# Altium project PCB_MCU.PrjPcb
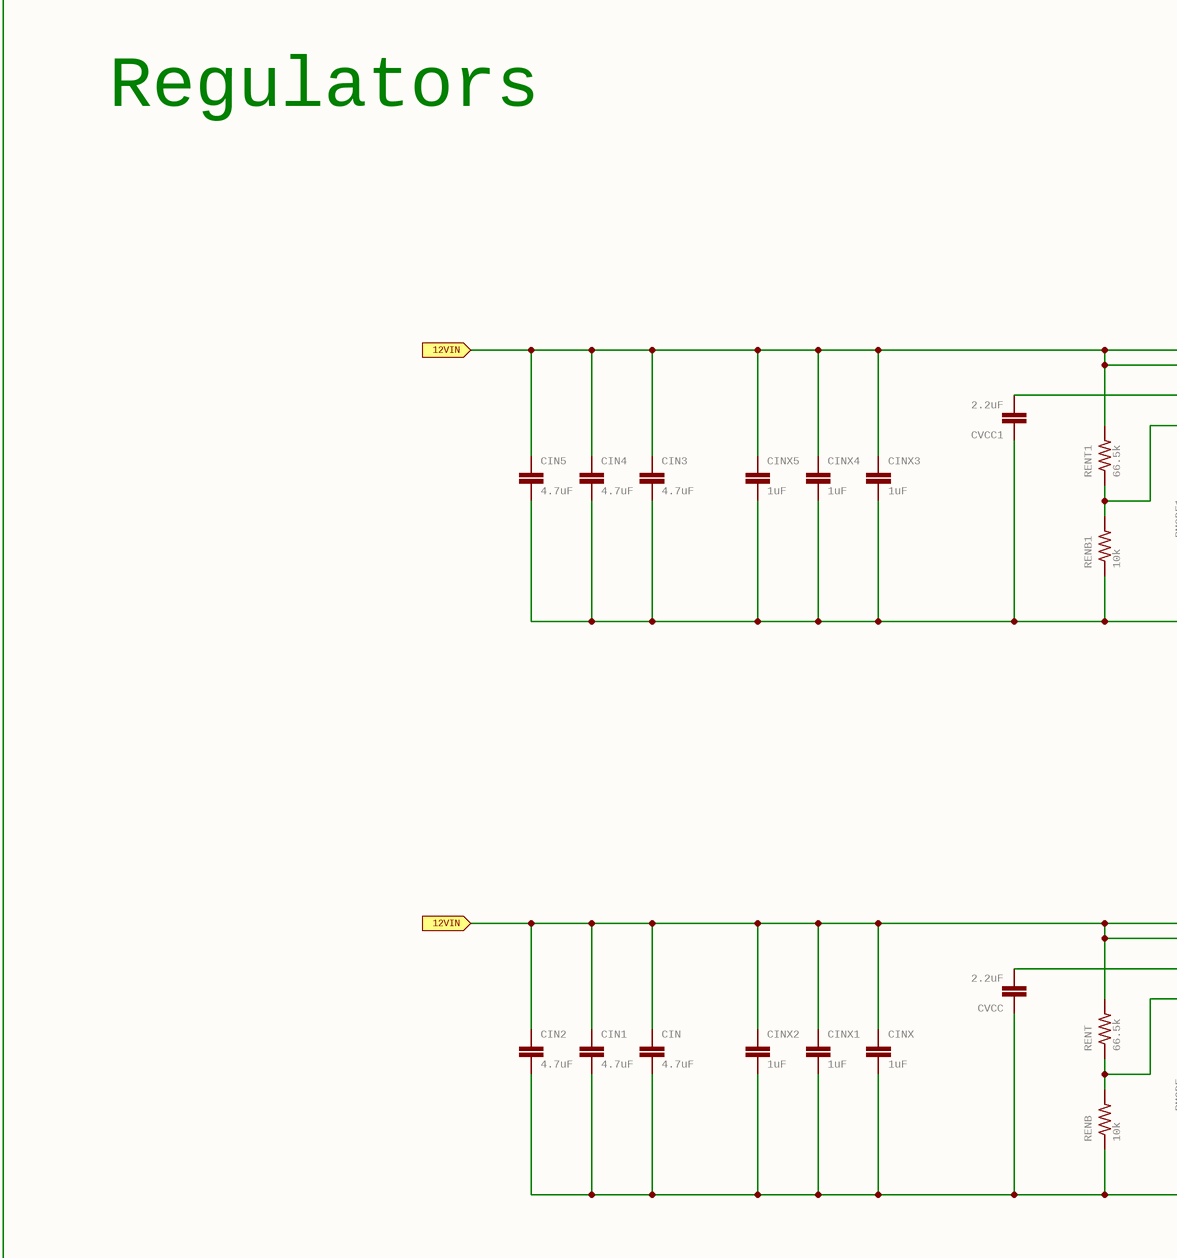
[diagram p0: PCB_MCU.SchDoc, top column 1 of 5]
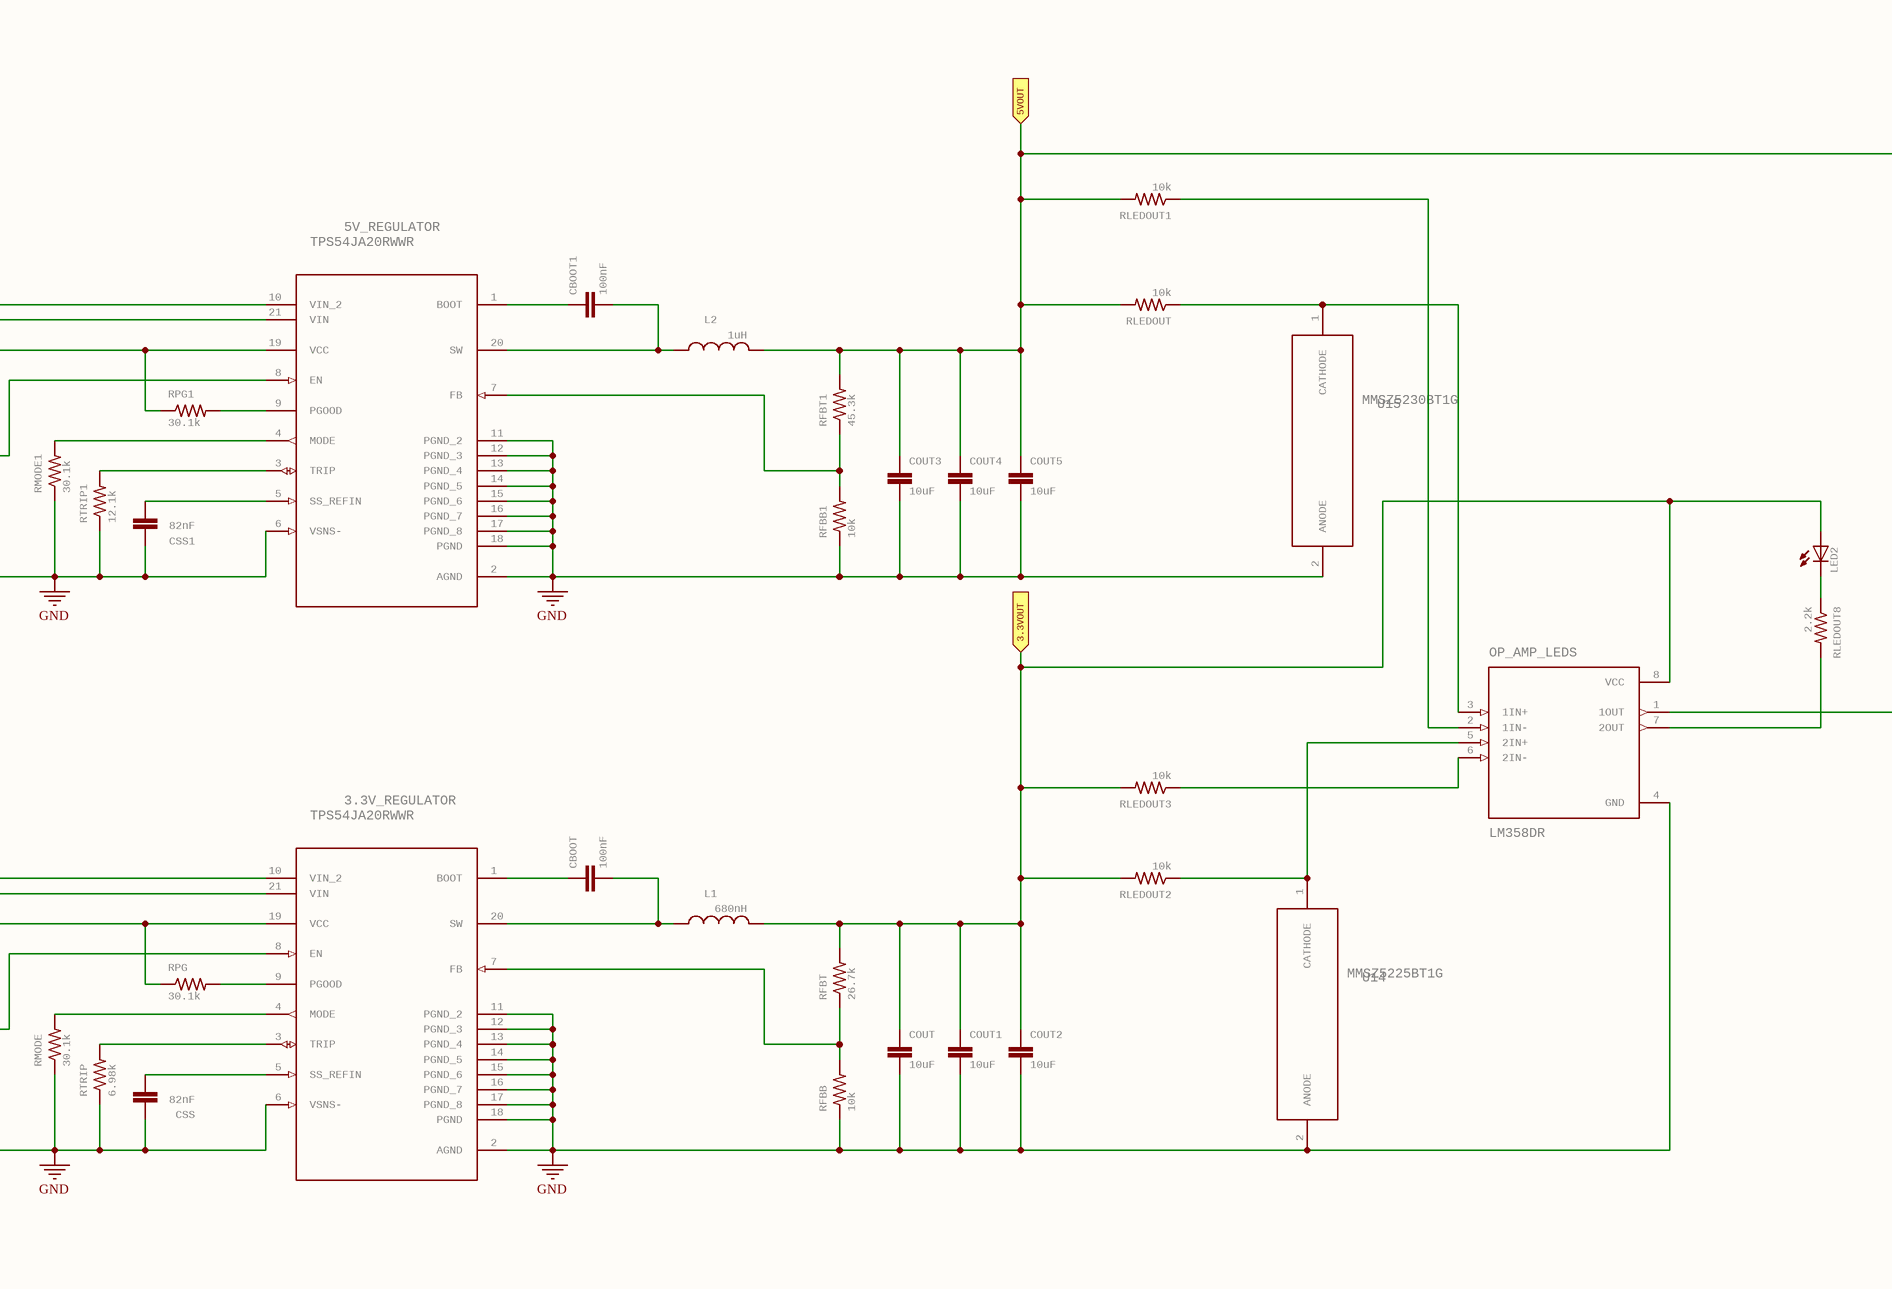
[diagram p1: PCB_MCU.SchDoc, top column 2 of 5]
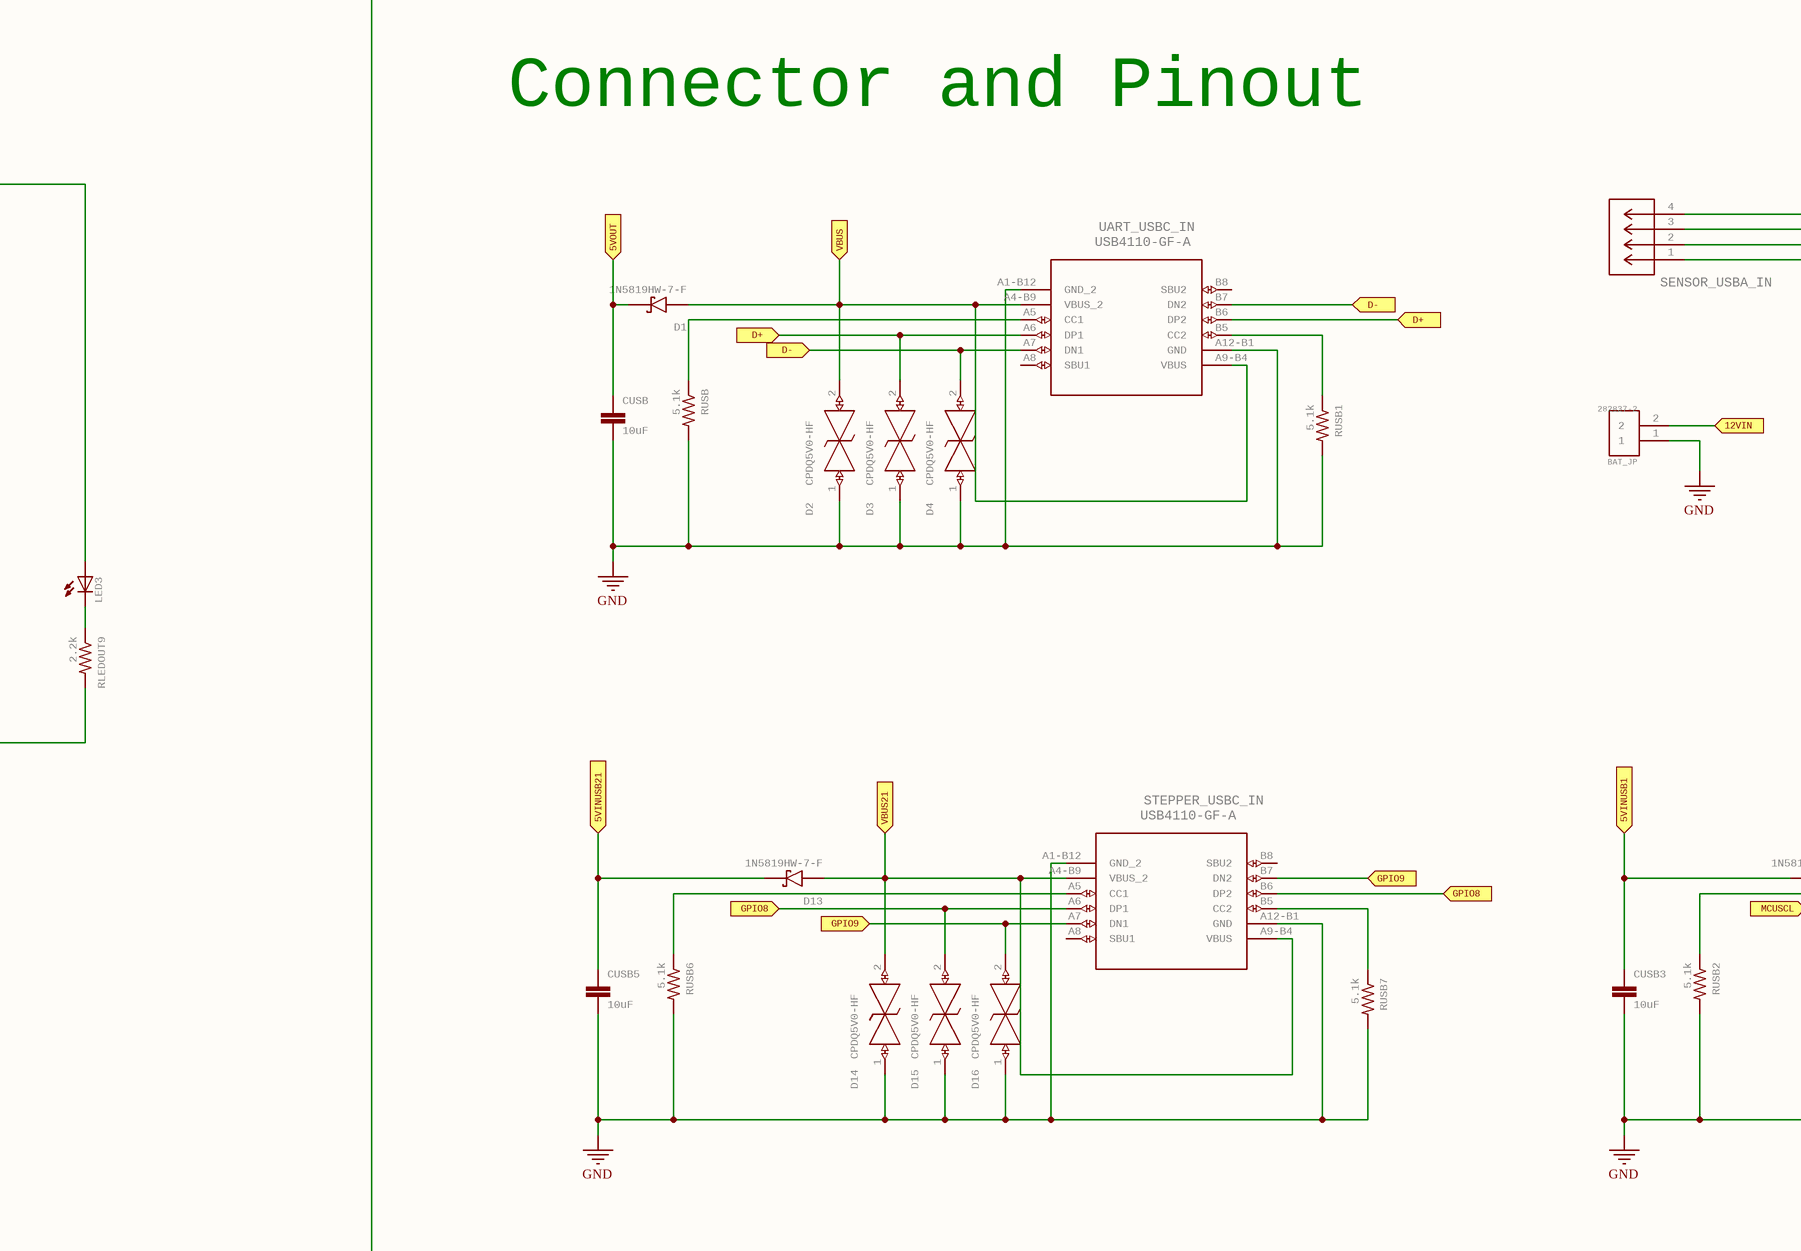
[diagram p2: PCB_MCU.SchDoc, top column 3 of 5]
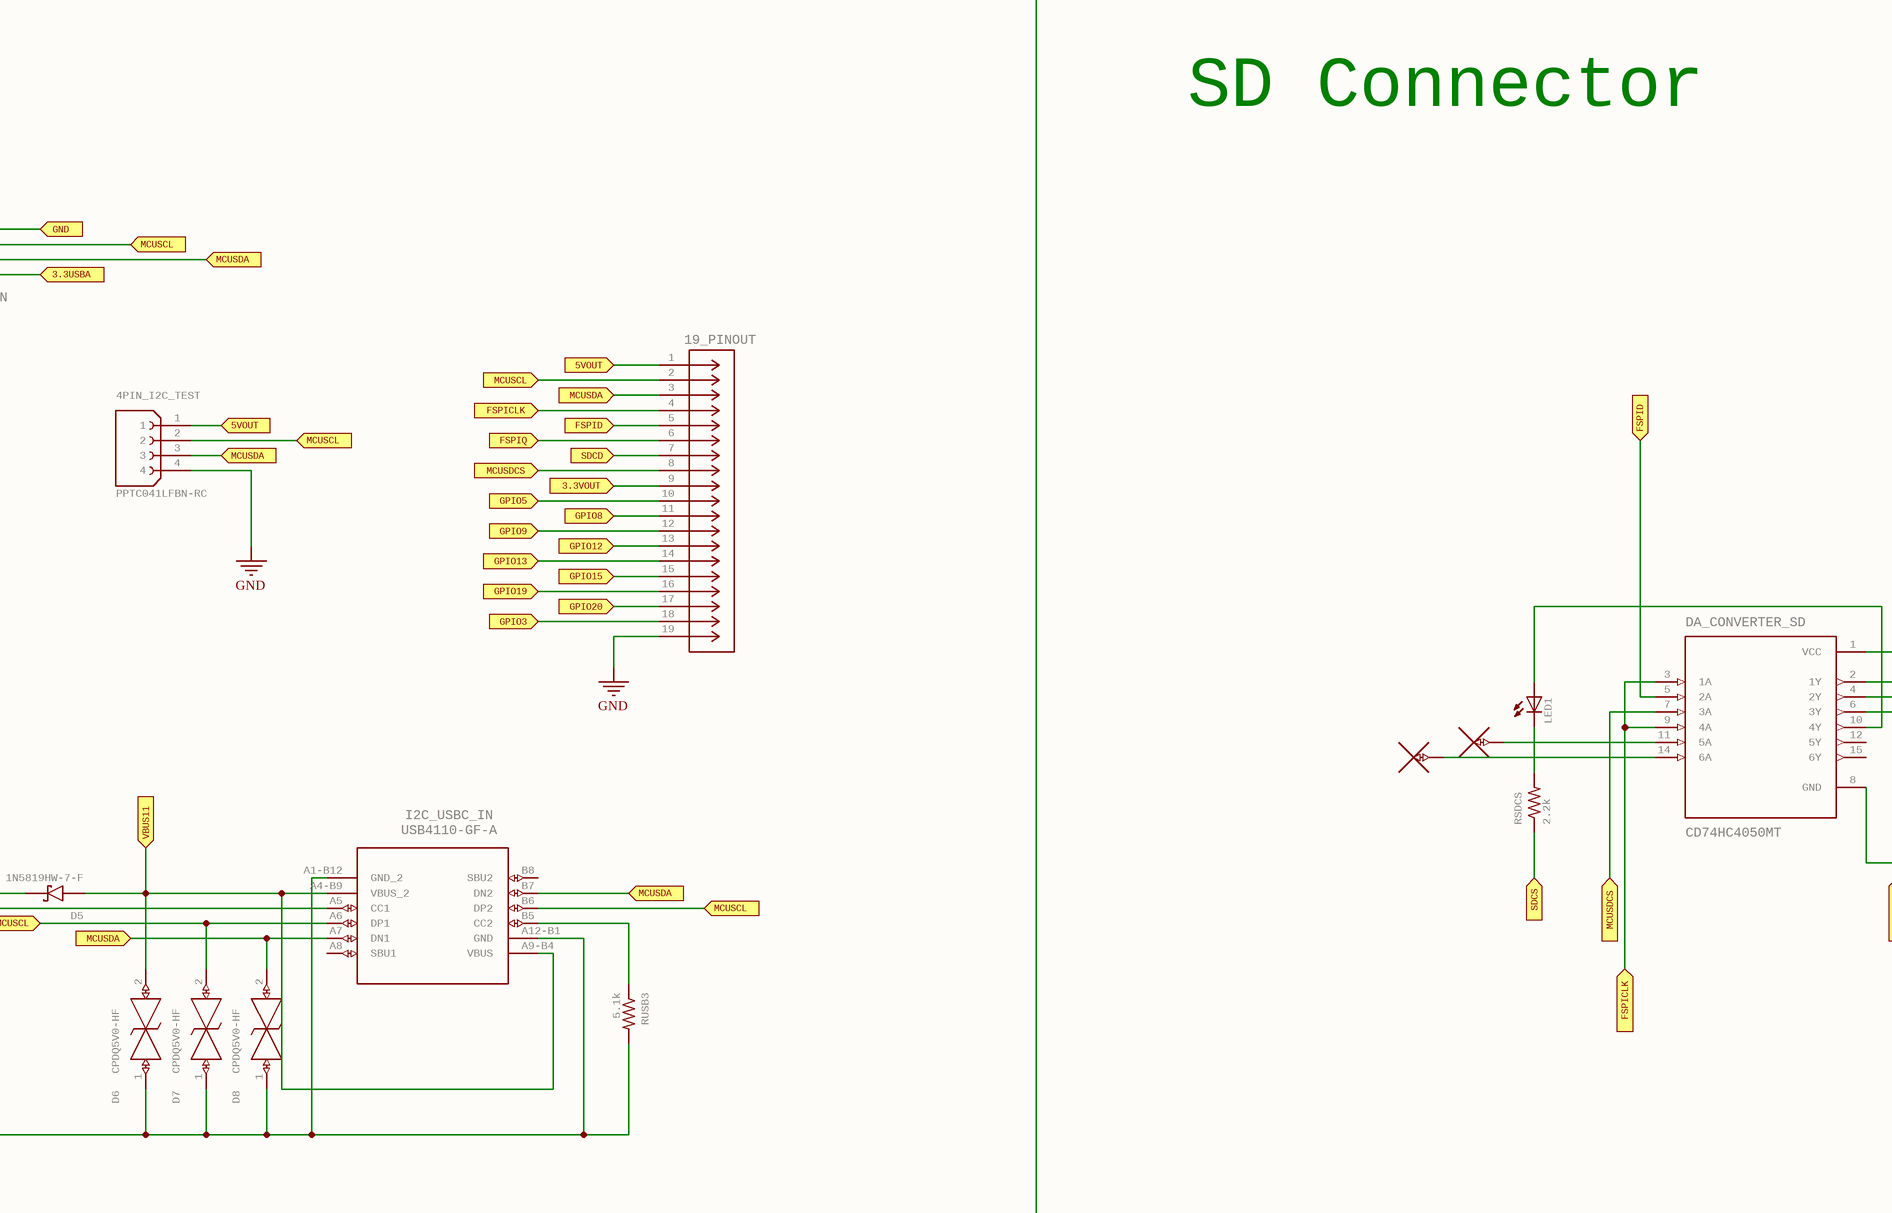
[diagram p3: PCB_MCU.SchDoc, top column 4 of 5]
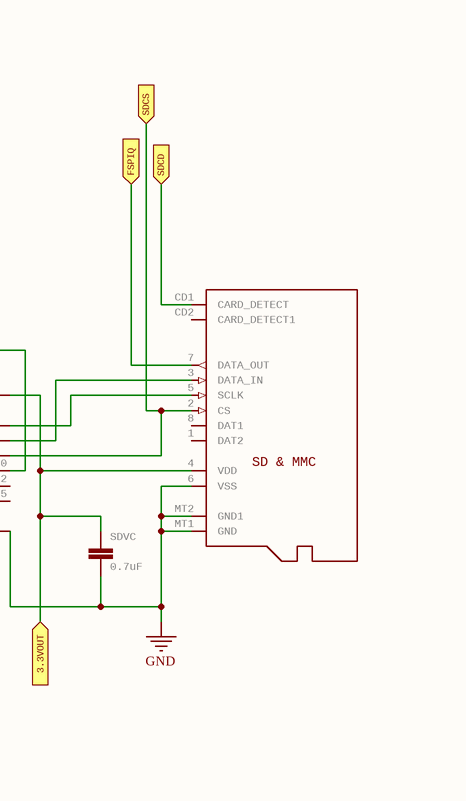
[diagram p4: PCB_MCU.SchDoc, top column 5 of 5]
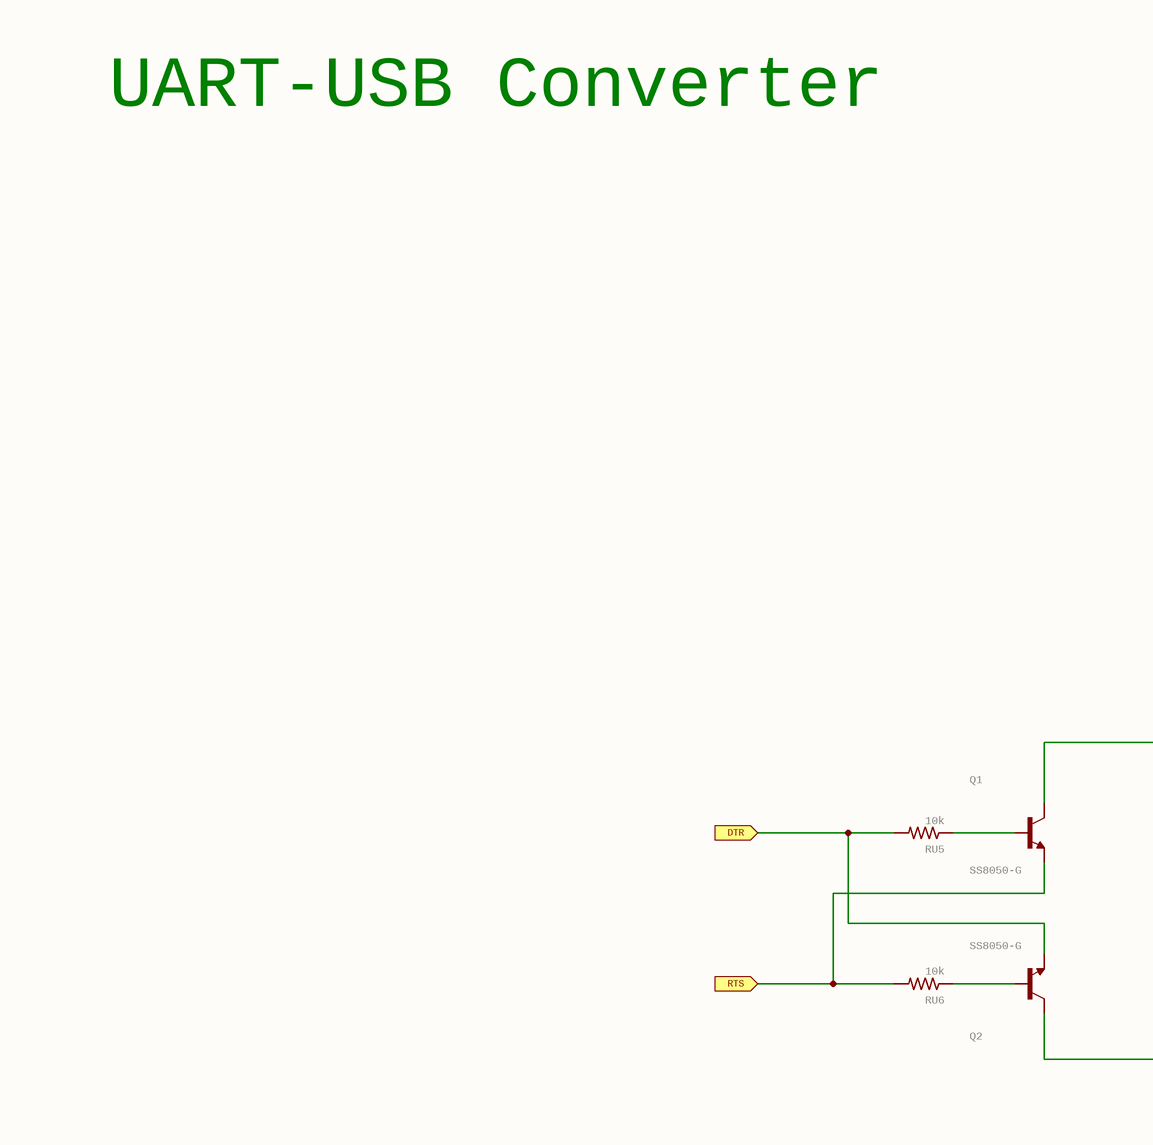
[diagram p5: PCB_MCU.SchDoc, bottom column 1 of 5]
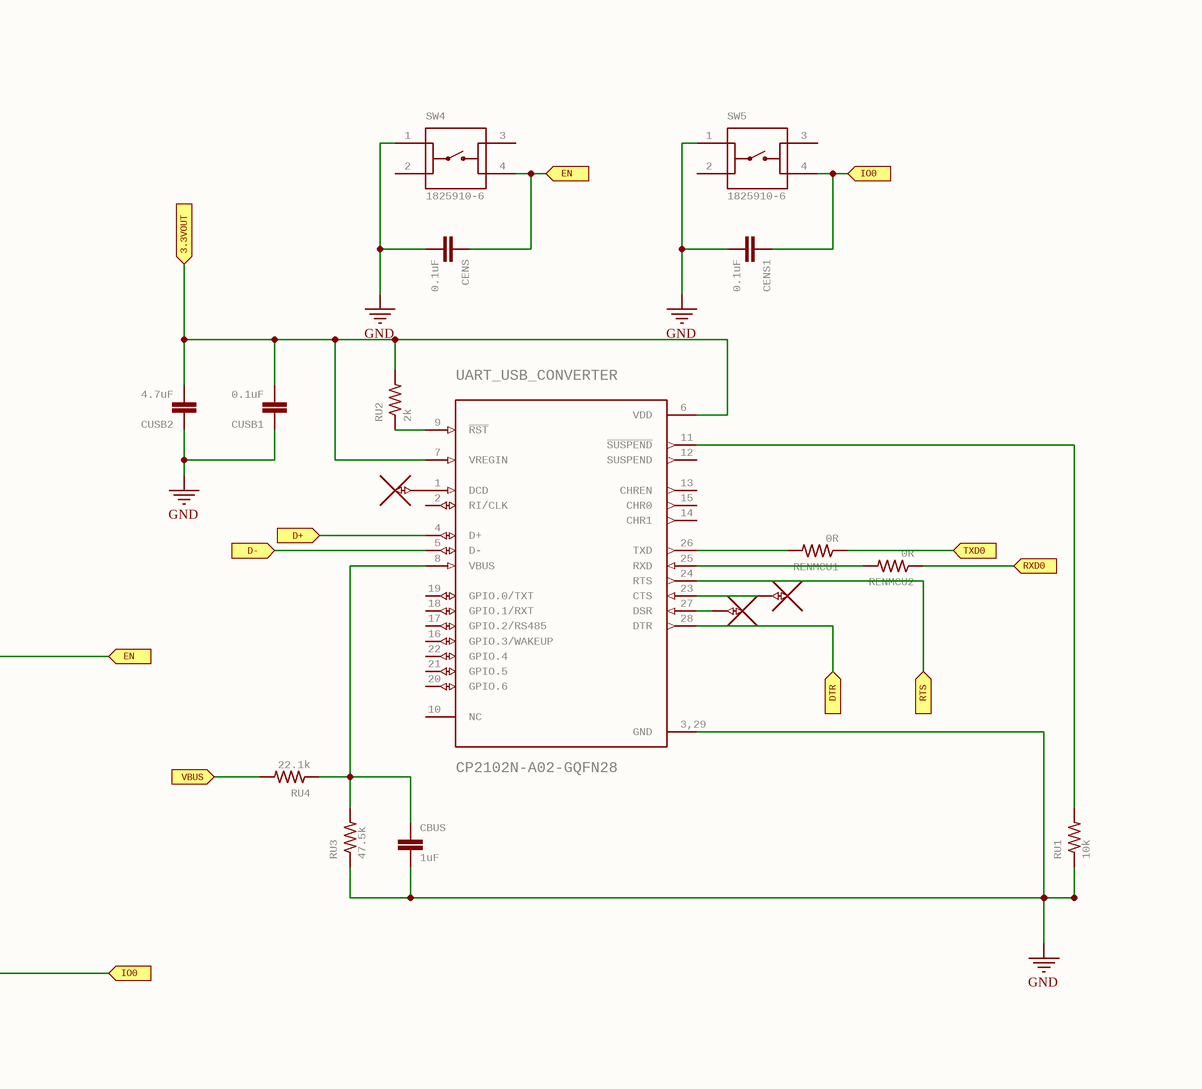
[diagram p6: PCB_MCU.SchDoc, bottom column 2 of 5]
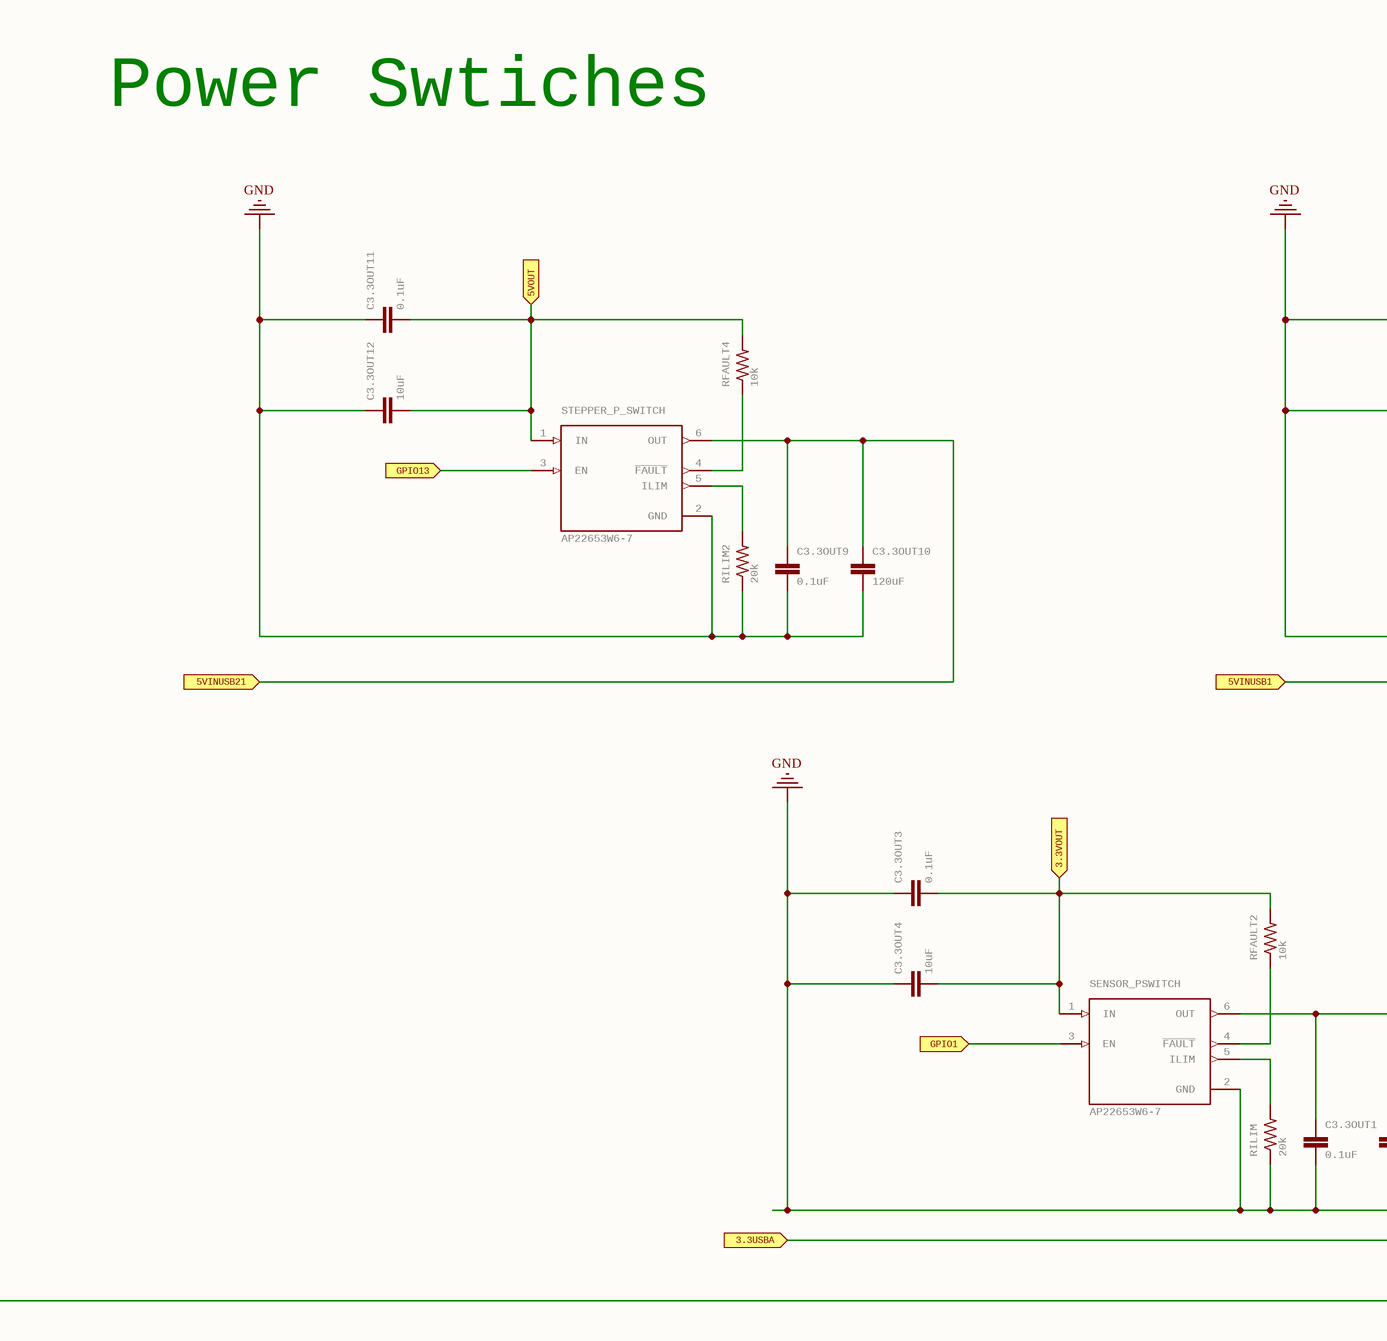
[diagram p7: PCB_MCU.SchDoc, bottom column 3 of 5]
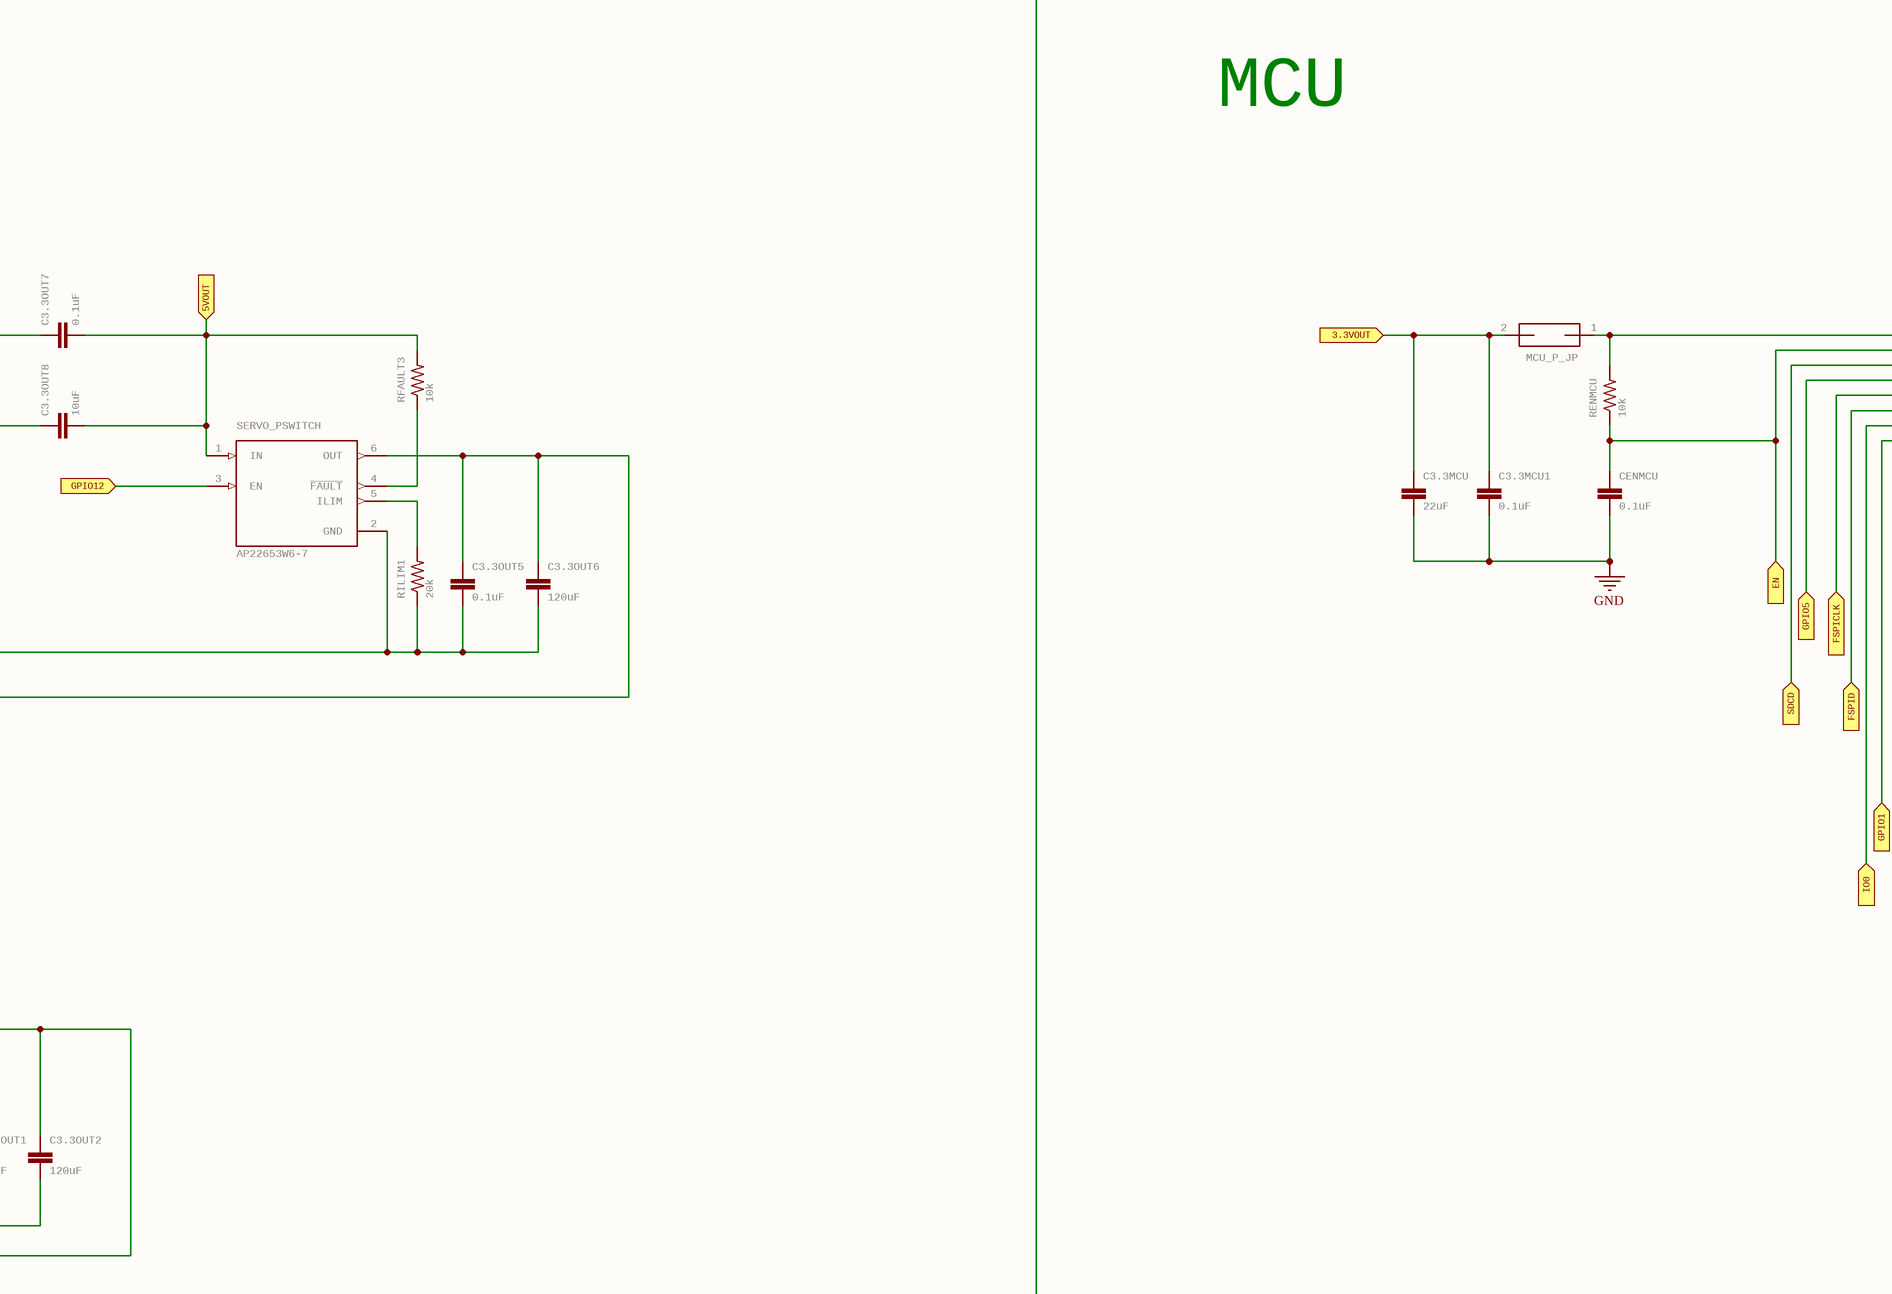
[diagram p8: PCB_MCU.SchDoc, bottom column 4 of 5]
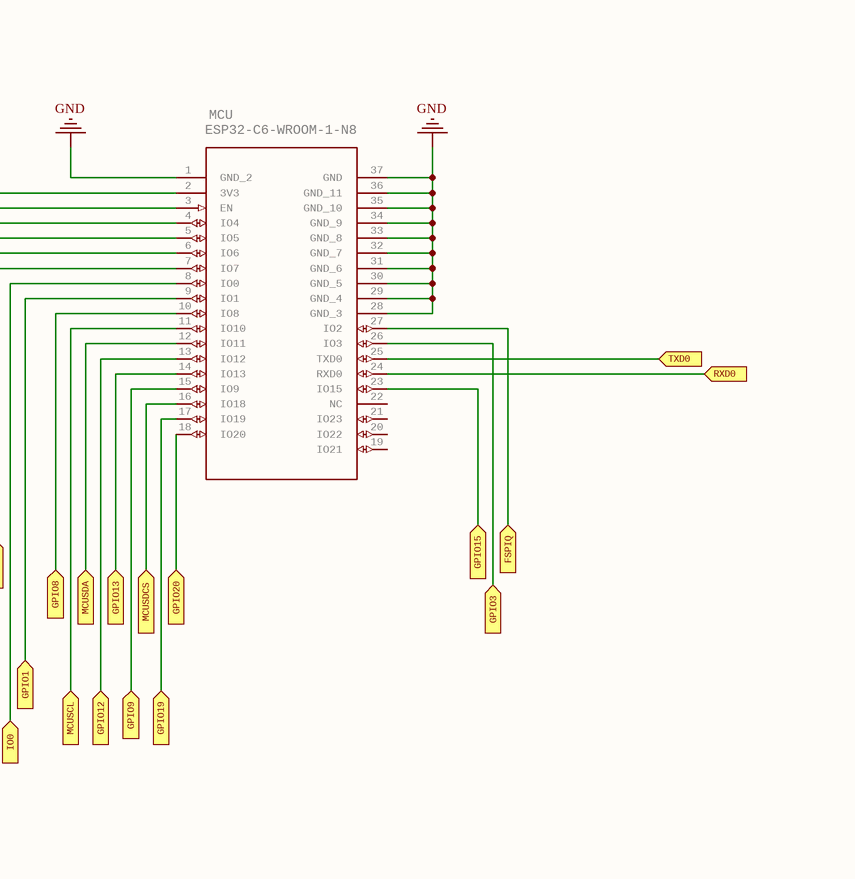
[diagram p9: PCB_MCU.SchDoc, bottom column 5 of 5]
1 sheet, 136 parts. Net scope: flat (ports and power ports of the same name join across sheets).

## Sheet PCB_MCU.SchDoc
size 1424 x 515 mm; Origin: Eagle

### Parts
3.3V_REGULATOR  TPS54JA20RWWR  [RWW0021A]
4PIN_I2C_TEST  PPTC041LFBN-RC  [SULLINS_PPTC041LFBN-RC]
5V_REGULATOR  TPS54JA20RWWR  [RWW0021A]
19_PINOUT  PPTC191LFBN-RC  [CONN19_PPTC191LFBN-RC_SUL]  (value not drawn)
BAT_JP  282837-2  [TE_282837-2]
C3.3MCU  22uF  [C0805]
C3.3MCU1  0.1uF  [C0805]
C3.3OUT1  0.1uF  [C0805]
C3.3OUT2  120uF  [C0805]
C3.3OUT3  0.1uF  [C0805]
C3.3OUT4  10uF  [C0805]
C3.3OUT5  0.1uF  [C0805]
C3.3OUT6  120uF  [C0805]
C3.3OUT7  0.1uF  [C0805]
C3.3OUT8  10uF  [C0805]
C3.3OUT9  0.1uF  [C0805]
C3.3OUT10  120uF  [C0805]
C3.3OUT11  0.1uF  [C0805]
C3.3OUT12  10uF  [C0805]
CBOOT  100nF  [C0805]
CBOOT1  100nF  [C0805]
CBUS  1uF  [C0805]
CENMCU  0.1uF  [C0805]
CENS  0.1uF  [C0805]
CENS1  0.1uF  [C0805]
CIN  4.7uF  [C0805]
CIN1  4.7uF  [C0805]
CIN2  4.7uF  [C0805]
CIN3  4.7uF  [C0805]
CIN4  4.7uF  [C0805]
CIN5  4.7uF  [C0805]
CINX  1uF  [C0805]
CINX1  1uF  [C0805]
CINX2  1uF  [C0805]
CINX3  1uF  [C0805]
CINX4  1uF  [C0805]
CINX5  1uF  [C0805]
COUT  10uF  [C0805]
COUT1  10uF  [C0805]
COUT2  10uF  [C0805]
COUT3  10uF  [C0805]
COUT4  10uF  [C0805]
COUT5  10uF  [C0805]
CSS  82nF  [C0805]
CSS1  82nF  [C0805]
CTS_NC  NC_MARKER  (value not drawn)
CUSB  10uF  [C0805]
CUSB1  0.1uF  [C0805]
CUSB2  4.7uF  [C0805]
CUSB3  10uF  [C0805]
CUSB5  10uF  [C0805]
CVCC  2.2uF  [C0805]
CVCC1  2.2uF  [C0805]
D1  1N5819HW-7-F  [SOD3715X145N]
D2  CPDQ5V0-HF  [MBTB-D-SOD-923F-IMP-0402]
D3  CPDQ5V0-HF  [MBTB-D-SOD-923F-IMP-0402]
D4  CPDQ5V0-HF  [MBTB-D-SOD-923F-IMP-0402]
D5  1N5819HW-7-F  [SOD3715X145N]
D6  CPDQ5V0-HF  [MBTB-D-SOD-923F-IMP-0402]
D7  CPDQ5V0-HF  [MBTB-D-SOD-923F-IMP-0402]
D8  CPDQ5V0-HF  [MBTB-D-SOD-923F-IMP-0402]
D13  1N5819HW-7-F  [SOD3715X145N]
D14  CPDQ5V0-HF  [MBTB-D-SOD-923F-IMP-0402]
D15  CPDQ5V0-HF  [MBTB-D-SOD-923F-IMP-0402]
D16  CPDQ5V0-HF  [MBTB-D-SOD-923F-IMP-0402]
DA_CONVERTER_SD  CD74HC4050MT  [SOIC127P600X175-16N]
DCD_NC  NC_MARKER  (value not drawn)
I2C_USBC_IN  USB4110-GF-A  [USB4110-GF-A_GCT]
L1  680nH  [6000-XXXX-RC]
L2  1uH  [6000-XXXX-RC]
LED1  LED  [SMARTLED-TTW]  (value not drawn)
LED2  LED  [SMARTLED-TTW]  (value not drawn)
LED3  LED  [SMARTLED-TTW]  (value not drawn)
MCU  ESP32-C6-WROOM-1-N8  [MOD28_ESP32-C6-WROOM-1_EXP]
MCU_P_JP  JP1Q  [JP1]  (value not drawn)
OP_AMP_LEDS  LM358DR  [SOIC127P599X175-8N]
Q1  SS8050-G  [TRANS_SS8050-G]
Q2  SS8050-G  [TRANS_SS8050-G]
RENB  10k  [M0805]
RENB1  10k  [M0805]
RENMCU  10k  [M0805]
RENMCU1  0R  [M0805]
RENMCU2  0R  [M0805]
RENT  66.5k  [M0805]
RENT1  66.5k  [M0805]
RFAULT2  10k  [M0805]
RFAULT3  10k  [M0805]
RFAULT4  10k  [M0805]
RFBB  10k  [M0805]
RFBB1  10k  [M0805]
RFBT  26.7k  [M0805]
RFBT1  45.3k  [M0805]
RILIM  20k  [M0805]
RILIM1  20k  [M0805]
RILIM2  20k  [M0805]
RLEDOUT  10k  [M0805]
RLEDOUT1  10k  [M0805]
RLEDOUT2  10k  [M0805]
RLEDOUT3  10k  [M0805]
RLEDOUT8  2.2k  [M0805]
RLEDOUT9  2.2k  [M0805]
RMODE  30.1k  [M0805]
RMODE1  30.1k  [M0805]
RPG  30.1k  [M0805]
RPG1  30.1k  [M0805]
RSDCS  2.2k  [M0805]
RTRIP  6.98k  [M0805]
RTRIP1  12.1k  [M0805]
RU1  10k  [M0805]
RU2  2k  [M0805]
RU3  47.5k  [M0805]
RU4  22.1k  [M0805]
RU5  10k  [M0805]
RU6  10k  [M0805]
RUSB  5.1k  [M0805]
RUSB1  5.1k  [M0805]
RUSB2  5.1k  [M0805]
RUSB3  5.1k  [M0805]
RUSB6  5.1k  [M0805]
RUSB7  5.1k  [M0805]
SD_CONNECTOR  SD&MMC: SD & MMC  [MICROSD]  (hidden comment: MICROSD)
SDVC  0.7uF  [C0805]
SENSOR_PSWITCH  AP22653W6-7  [SOT95P280X145-6N]
SENSOR_USBA_IN  USB-AP-S-RA-SMT  [CONN_USB-AP-S-RA-SMT_ADM]  (value not drawn)
SERVO_PSWITCH  AP22653W6-7  [SOT95P280X145-6N]
STEPPER_P_SWITCH  AP22653W6-7  [SOT95P280X145-6N]
STEPPER_USBC_IN  USB4110-GF-A  [USB4110-GF-A_GCT]
SW4  1825910-6  [SW_1825910-6-4]
SW5  1825910-6  [SW_1825910-6-4]
U14  MMSZ5225BT1G  [SOD-123_ONS]
U15  MMSZ5230BT1G  [SOD-123_ONS]
U$2  NC_MARKER  (value not drawn)
U$10  NC_MARKER  (value not drawn)
U$11  NC_MARKER  (value not drawn)
UART_USB_CONVERTER  CP2102N-A02-GQFN28  [QFN50P500X500X80-29N]
UART_USBC_IN  USB4110-GF-A  [USB4110-GF-A_GCT]

### Blocks framed on the sheet
Regulators: 3.3V_REGULATOR 5V_REGULATOR CBOOT CBOOT1 CIN CIN1-CIN5 CINX CINX1-CINX5 COUT COUT1-COUT5 CSS CSS1 CVCC CVCC1 L1 L2 LED2 LED3 OP_AMP_LEDS RENB RENB1 RENT RENT1 RFBB RFBB1 RFBT RFBT1 RLEDOUT RLEDOUT1-RLEDOUT3 RLEDOUT8 RLEDOUT9 RMODE RMODE1 RPG RPG1 RTRIP RTRIP1 U14 U15
Connector and Pinout: 4PIN_I2C_TEST 19_PINOUT BAT_JP CUSB CUSB3 CUSB5 D1-D8 D13-D16 I2C_USBC_IN RUSB RUSB1-RUSB3 RUSB6 RUSB7 SENSOR_USBA_IN STEPPER_USBC_IN UART_USBC_IN
SD Connector: DA_CONVERTER_SD LED1 RSDCS SD_CONNECTOR SDVC U$10 U$11
UART-USB Converter: CBUS CENS CENS1 CTS_NC CUSB1 CUSB2 DCD_NC Q1 Q2 RENMCU1 RENMCU2 RU1-RU6 SW4 SW5 U$2 UART_USB_CONVERTER
Power Swtiches: C3.3OUT1-C3.3OUT12 RFAULT2-RFAULT4 RILIM RILIM1 RILIM2 SENSOR_PSWITCH SERVO_PSWITCH STEPPER_P_SWITCH
MCU: C3.3MCU C3.3MCU1 CENMCU MCU MCU_P_JP RENMCU

### Ports
3.3USBA (in), 3.3VOUT (in), 5VINUSB1 (in), 5VINUSB21 (in), 5VOUT (in), 12VIN (in), D+ (in), D- (in), DTR (in), EN (in), FSPICLK (in), FSPID (in), FSPIQ (in), GND (in), GPIO1 (in), GPIO3 (in), GPIO5 (in), GPIO8 (in), GPIO9 (in), GPIO12 (in), GPIO13 (in), GPIO15 (in), GPIO19 (in), GPIO20 (in), IO0 (in), MCUSCL (in), MCUSDA (in), MCUSDCS (in), RTS (in), RXD0 (in), SDCD (in), SDCS (in), TXD0 (in), VBUS11 (in), VBUS21 (in), VBUS (in)

### Nets
GND: 3.3V_REGULATOR.2(AGND) 3.3V_REGULATOR.6(VSNS-) 3.3V_REGULATOR.11(PGND_2) 3.3V_REGULATOR.12(PGND_3) 3.3V_REGULATOR.13(PGND_4) 3.3V_REGULATOR.14(PGND_5) 3.3V_REGULATOR.15(PGND_6) 3.3V_REGULATOR.16(PGND_7) 3.3V_REGULATOR.17(PGND_8) 3.3V_REGULATOR.18(PGND) 4PIN_I2C_TEST.4 5V_REGULATOR.2(AGND) 5V_REGULATOR.6(VSNS-) 5V_REGULATOR.11(PGND_2) 5V_REGULATOR.12(PGND_3) 5V_REGULATOR.13(PGND_4) 5V_REGULATOR.14(PGND_5) 5V_REGULATOR.15(PGND_6) 5V_REGULATOR.16(PGND_7) 5V_REGULATOR.17(PGND_8) 5V_REGULATOR.18(PGND) 19_PINOUT.19 BAT_JP.1 C3.3MCU.2 C3.3MCU1.2 C3.3OUT1.2 C3.3OUT2.2 C3.3OUT3.1 C3.3OUT4.1 C3.3OUT5.2 C3.3OUT6.2 C3.3OUT7.1 C3.3OUT8.1 C3.3OUT9.2 C3.3OUT10.2 C3.3OUT11.1 C3.3OUT12.1 CBUS.2 CENMCU.2 CENS.2 CENS1.2 CIN.2 CIN1.2 CIN2.2 CIN3.2 CIN4.2 CIN5.2 CINX.2 CINX1.2 CINX2.2 CINX3.2 CINX4.2 CINX5.2 COUT.2 COUT1.2 COUT2.2 COUT3.2 COUT4.2 COUT5.2 CSS.1 CSS1.1 CUSB.2 CUSB1.1 CUSB2.1 CUSB3.2 CUSB5.2 CVCC.1 CVCC1.1 D2.1(K) D3.1(K) D4.1(K) D6.1(K) D7.1(K) D8.1(K) D14.1(K) D15.1(K) D16.1(K) DA_CONVERTER_SD.8(GND) I2C_USBC_IN.A1-B12(GND_2) I2C_USBC_IN.A12-B1(GND) MCU.1(GND_2) MCU.28(GND_3) MCU.29(GND_4) MCU.30(GND_5) MCU.31(GND_6) MCU.32(GND_7) MCU.33(GND_8) MCU.34(GND_9) MCU.35(GND_10) MCU.36(GND_11) MCU.37(GND) OP_AMP_LEDS.4(GND) RENB.1 RENB1.1 RFBB.1 RFBB1.1 RILIM.1 RILIM1.1 RILIM2.1 RMODE.1 RMODE1.1 RTRIP.1 RTRIP1.1 RU1.1 RU3.1 RUSB.2 RUSB1.2 RUSB2.2 RUSB3.2 RUSB6.2 RUSB7.2 SD_CONNECTOR.6(VSS) SD_CONNECTOR.MT1(GND) SD_CONNECTOR.MT2(GND1) SDVC.2 SENSOR_PSWITCH.2(GND) SERVO_PSWITCH.2(GND) STEPPER_P_SWITCH.2(GND) STEPPER_USBC_IN.A1-B12(GND_2) STEPPER_USBC_IN.A12-B1(GND) SW4.1 SW5.1 U14.2(ANODE) U15.2(ANODE) UART_USB_CONVERTER.3,29(GND) UART_USBC_IN.A1-B12(GND_2) UART_USBC_IN.A12-B1(GND)
Net3.3V_REGULATOR_1: 3.3V_REGULATOR.1(BOOT) CBOOT.1
Net3.3V_REGULATOR_3: 3.3V_REGULATOR.3(TRIP) RTRIP.2
Net3.3V_REGULATOR_4: 3.3V_REGULATOR.4(MODE) RMODE.2
Net3.3V_REGULATOR_5: 3.3V_REGULATOR.5(SS_REFIN) CSS.2
Net3.3V_REGULATOR_7: 3.3V_REGULATOR.7(FB) RFBB.2 RFBT.1
Net3.3V_REGULATOR_8: 3.3V_REGULATOR.8(EN) RENB.2 RENT.1
Net3.3V_REGULATOR_9: 3.3V_REGULATOR.9(PGOOD) RPG.2
Net3.3V_REGULATOR_10: 3.3V_REGULATOR.10(VIN_2) 3.3V_REGULATOR.21(VIN) 5V_REGULATOR.10(VIN_2) 5V_REGULATOR.21(VIN) BAT_JP.2 CIN.1 CIN1.1 CIN2.1 CIN3.1 CIN4.1 CIN5.1 CINX.1 CINX1.1 CINX2.1 CINX3.1 CINX4.1 CINX5.1 RENT.2 RENT1.2 ; port 12VIN
Net3.3V_REGULATOR_19: 3.3V_REGULATOR.19(VCC) CVCC.2 RPG.1
Net3.3V_REGULATOR_20: 3.3V_REGULATOR.20(SW) CBOOT.2 L1.1
Net4PIN_I2C_TEST_1: 4PIN_I2C_TEST.1 19_PINOUT.1 C3.3OUT7.2 C3.3OUT8.2 C3.3OUT11.2 C3.3OUT12.2 COUT3.1 COUT4.1 COUT5.1 CUSB.1 D1.C(K) L2.2 LED3.A@1(A) RFAULT3.2 RFAULT4.2 RFBT1.2 RLEDOUT.2 RLEDOUT1.2 SERVO_PSWITCH.1(IN) STEPPER_P_SWITCH.1(IN) ; port 5VOUT
Net4PIN_I2C_TEST_2: 4PIN_I2C_TEST.2 19_PINOUT.2 D7.2(A) I2C_USBC_IN.A6(DP1) I2C_USBC_IN.B6(DP2) MCU.11(IO10) SENSOR_USBA_IN.3 ; port MCUSCL
Net4PIN_I2C_TEST_3: 4PIN_I2C_TEST.3 19_PINOUT.3 D8.2(A) I2C_USBC_IN.A7(DN1) I2C_USBC_IN.B7(DN2) MCU.12(IO11) SENSOR_USBA_IN.2 ; port MCUSDA
Net5V_REGULATOR_1: 5V_REGULATOR.1(BOOT) CBOOT1.1
Net5V_REGULATOR_3: 5V_REGULATOR.3(TRIP) RTRIP1.2
Net5V_REGULATOR_4: 5V_REGULATOR.4(MODE) RMODE1.2
Net5V_REGULATOR_5: 5V_REGULATOR.5(SS_REFIN) CSS1.2
Net5V_REGULATOR_7: 5V_REGULATOR.7(FB) RFBB1.2 RFBT1.1
Net5V_REGULATOR_8: 5V_REGULATOR.8(EN) RENB1.2 RENT1.1
Net5V_REGULATOR_9: 5V_REGULATOR.9(PGOOD) RPG1.2
Net5V_REGULATOR_19: 5V_REGULATOR.19(VCC) CVCC1.2 RPG1.1
Net5V_REGULATOR_20: 5V_REGULATOR.20(SW) CBOOT1.2 L2.1
Net19_PINOUT_4: 19_PINOUT.4 DA_CONVERTER_SD.3(1A) DA_CONVERTER_SD.9(4A) MCU.6(IO6) ; port FSPICLK
Net19_PINOUT_5: 19_PINOUT.5 DA_CONVERTER_SD.5(2A) MCU.7(IO7) ; port FSPID
Net19_PINOUT_6: 19_PINOUT.6 MCU.27(IO2) SD_CONNECTOR.7(DATA_OUT) ; port FSPIQ
Net19_PINOUT_7: 19_PINOUT.7 MCU.4(IO4) SD_CONNECTOR.CD1(CARD_DETECT) ; port SDCD
Net19_PINOUT_8: 19_PINOUT.8 DA_CONVERTER_SD.7(3A) MCU.16(IO18) ; port MCUSDCS
Net19_PINOUT_9: 19_PINOUT.9 C3.3MCU.1 C3.3MCU1.1 C3.3OUT3.2 C3.3OUT4.2 COUT.1 COUT1.1 COUT2.1 CUSB1.2 CUSB2.2 DA_CONVERTER_SD.1(VCC) L1.2 LED2.A@1(A) MCU_P_JP.2 OP_AMP_LEDS.8(VCC) RFAULT2.2 RFBT.2 RLEDOUT2.2 RLEDOUT3.2 RU2.2 SD_CONNECTOR.4(VDD) SDVC.1 SENSOR_PSWITCH.1(IN) UART_USB_CONVERTER.6(VDD) UART_USB_CONVERTER.7(VREGIN) ; port 3.3VOUT
Net19_PINOUT_10: 19_PINOUT.10 MCU.5(IO5) ; port GPIO5
Net19_PINOUT_11: 19_PINOUT.11 D15.2(A) MCU.10(IO8) STEPPER_USBC_IN.A6(DP1) STEPPER_USBC_IN.B6(DP2) ; port GPIO8
Net19_PINOUT_12: 19_PINOUT.12 D16.2(A) MCU.15(IO9) STEPPER_USBC_IN.A7(DN1) STEPPER_USBC_IN.B7(DN2) ; port GPIO9
Net19_PINOUT_13: 19_PINOUT.13 MCU.13(IO12) SERVO_PSWITCH.3(EN) ; port GPIO12
Net19_PINOUT_14: 19_PINOUT.14 MCU.14(IO13) STEPPER_P_SWITCH.3(EN) ; port GPIO13
Net19_PINOUT_15: 19_PINOUT.15 MCU.23(IO15) ; port GPIO15
Net19_PINOUT_16: 19_PINOUT.16 MCU.17(IO19) ; port GPIO19
Net19_PINOUT_17: 19_PINOUT.17 MCU.18(IO20) ; port GPIO20
Net19_PINOUT_18: 19_PINOUT.18 MCU.26(IO3) ; port GPIO3
NetC3.3OUT1_1: C3.3OUT1.1 C3.3OUT2.1 SENSOR_PSWITCH.6(OUT) SENSOR_USBA_IN.1 ; port 3.3USBA
NetC3.3OUT5_1: C3.3OUT5.1 C3.3OUT6.1 CUSB3.1 D5.C(K) SERVO_PSWITCH.6(OUT) ; port 5VINUSB1
NetC3.3OUT9_1: C3.3OUT9.1 C3.3OUT10.1 CUSB5.1 D13.C(K) STEPPER_P_SWITCH.6(OUT) ; port 5VINUSB21
NetCBUS_1: CBUS.1 RU3.2 RU4.1 UART_USB_CONVERTER.8(VBUS)
NetCENMCU_1: CENMCU.1 CENS.1 MCU.3(EN) Q1.3(C) RENMCU.1 SW4.4 ; port EN
NetCENS1_1: CENS1.1 MCU.8(IO0) Q2.3(C) SW5.4 ; port IO0
NetCTS_NC_?1: CTS_NC.?1(P$1) UART_USB_CONVERTER.23(CTS)
NetD1_A: D1.A D2.2(A) RU4.2 UART_USBC_IN.A4-B9(VBUS_2) UART_USBC_IN.A9-B4(VBUS) ; port VBUS
NetD3_2: D3.2(A) UART_USB_CONVERTER.4(D+) UART_USBC_IN.A6(DP1) UART_USBC_IN.B6(DP2) ; port D+
NetD4_2: D4.2(A) UART_USB_CONVERTER.5(D-) UART_USBC_IN.A7(DN1) UART_USBC_IN.B7(DN2) ; port D-
NetD5_A: D5.A D6.2(A) I2C_USBC_IN.A4-B9(VBUS_2) I2C_USBC_IN.A9-B4(VBUS) ; port VBUS11
NetD13_A: D13.A D14.2(A) STEPPER_USBC_IN.A4-B9(VBUS_2) STEPPER_USBC_IN.A9-B4(VBUS) ; port VBUS21
NetDA_CONVERTER_SD_2: DA_CONVERTER_SD.2(1Y) SD_CONNECTOR.5(SCLK)
NetDA_CONVERTER_SD_4: DA_CONVERTER_SD.4(2Y) SD_CONNECTOR.3(DATA_IN)
NetDA_CONVERTER_SD_6: DA_CONVERTER_SD.6(3Y) RSDCS.1 SD_CONNECTOR.2(CS) ; port SDCS
NetDA_CONVERTER_SD_10: DA_CONVERTER_SD.10(4Y) LED1.A@1(A)
NetDA_CONVERTER_SD_11: DA_CONVERTER_SD.11(5A) U$10.?1(P$1)
NetDA_CONVERTER_SD_14: DA_CONVERTER_SD.14(6A) U$11.?1(P$1)
NetDCD_NC_?1: DCD_NC.?1(P$1) UART_USB_CONVERTER.1(DCD)
NetI2C_USBC_IN_A5: I2C_USBC_IN.A5(CC1) RUSB2.1
NetI2C_USBC_IN_B5: I2C_USBC_IN.B5(CC2) RUSB3.1
NetLED1_C@1: LED1.C@1(C) RSDCS.2
NetLED2_C@1: LED2.C@1(C) RLEDOUT8.1
NetLED3_C@1: LED3.C@1(C) RLEDOUT9.1
NetMCU_2: MCU.2(3V3) MCU_P_JP.1 RENMCU.2
NetMCU_9: MCU.9(IO1) SENSOR_PSWITCH.3(EN) ; port GPIO1
NetMCU_24: MCU.24(RXD0) RENMCU2.1 ; port RXD0
NetMCU_25: MCU.25(TXD0) RENMCU1.1 ; port TXD0
NetOP_AMP_LEDS_1: OP_AMP_LEDS.1(1OUT) RLEDOUT9.2
NetOP_AMP_LEDS_2: OP_AMP_LEDS.2(1IN-) RLEDOUT1.1
NetOP_AMP_LEDS_3: OP_AMP_LEDS.3(1IN+) RLEDOUT.1 U15.1(CATHODE)
NetOP_AMP_LEDS_5: OP_AMP_LEDS.5(2IN+) RLEDOUT2.1 U14.1(CATHODE)
NetOP_AMP_LEDS_6: OP_AMP_LEDS.6(2IN-) RLEDOUT3.1
NetOP_AMP_LEDS_7: OP_AMP_LEDS.7(2OUT) RLEDOUT8.2
NetQ1_1: Q1.1(B) RU5.1
NetQ1_2: Q1.2(E) RU6.2 UART_USB_CONVERTER.24(RTS) ; port RTS
NetQ2_1: Q2.1(B) RU6.1
NetQ2_2: Q2.2(E) RU5.2 UART_USB_CONVERTER.28(DTR) ; port DTR
NetRENMCU1_2: RENMCU1.2 UART_USB_CONVERTER.26(TXD)
NetRENMCU2_2: RENMCU2.2 UART_USB_CONVERTER.25(RXD)
NetRFAULT2_1: RFAULT2.1 SENSOR_PSWITCH.4(~{FAULT})
NetRFAULT3_1: RFAULT3.1 SERVO_PSWITCH.4(~{FAULT})
NetRFAULT4_1: RFAULT4.1 STEPPER_P_SWITCH.4(~{FAULT})
NetRILIM1_2: RILIM1.2 SERVO_PSWITCH.5(ILIM)
NetRILIM2_2: RILIM2.2 STEPPER_P_SWITCH.5(ILIM)
NetRILIM_2: RILIM.2 SENSOR_PSWITCH.5(ILIM)
NetRU1_2: RU1.2 UART_USB_CONVERTER.11(~{SUSPEND})
NetRU2_1: RU2.1 UART_USB_CONVERTER.9(~{RST})
NetRUSB1_1: RUSB1.1 UART_USBC_IN.B5(CC2)
NetRUSB6_1: RUSB6.1 STEPPER_USBC_IN.A5(CC1)
NetRUSB7_1: RUSB7.1 STEPPER_USBC_IN.B5(CC2)
NetRUSB_1: RUSB.1 UART_USBC_IN.A5(CC1)
NetSENSOR_USBA_IN_4: SENSOR_USBA_IN.4 ; port GND
NetU$2_?1: U$2.?1(P$1) UART_USB_CONVERTER.27(DSR)

Not connected (* = marked no-connect by the designer): DA_CONVERTER_SD 12(5Y) 15(6Y); I2C_USBC_IN A8(SBU1) B8(SBU2); MCU 19(IO21) 20(IO22) 21(IO23) 22(NC); SD_CONNECTOR 1(DAT2) 8(DAT1) CD2(CARD_DETECT1); STEPPER_USBC_IN A8(SBU1) B8(SBU2); SW4 2 3; SW5 2 3; UART_USB_CONVERTER 2(RI/CLK) 10(NC) 12(SUSPEND) 13(CHREN) 14(CHR1) 15(CHR0) 16(GPIO.3/WAKEUP) 17(GPIO.2/RS485) 18(GPIO.1/RXT) 19(GPIO.0/TXT) 20(GPIO.6) 21(GPIO.5) 22(GPIO.4); UART_USBC_IN A8(SBU1) B8(SBU2)

### Library data of the parts
3.3V_REGULATOR 5V_REGULATOR = TPS54JA20RWWR: GateName_1: A; SymbolName_1: TPS54JA20RWW; LibraryName: TPS54JA20RWWR; DeviceSetName: TPS54JA20RWWR; MANUFACTURER_PART_NUMBER: TPS54JA20RWWR
4PIN_I2C_TEST = PPTC041LFBN-RC: 4 Position Header Connector Through Hole  Check availability; GateName_1: G$1; MF: Sullins Connector; SymbolName_1: PPTC041LFBN-RC; LibraryName: PPTC041LFBN-RC; DeviceSetName: PPTC041LFBN-RC; AVAILABILITY: In Stock; CHECK_PRICES: https://www.snapeda.com/parts/PPTC041LFBN-RC/Sullins+Connector+Solutions/view-part/?ref=eda; MP: PPTC041LFBN-RC; PACKAGE: None; PRICE: None; PURCHASE-URL: https://www.snapeda.com/api/url_track_click_mouser/?unipart_id=285917&manufacturer=Sullins Connector&part_name=PPTC041LFBN-RC&search_term=pptc041lfbn-rc; SNAPEDA_LINK: https://www.snapeda.com/parts/PPTC041LFBN-RC/Sullins+Connector+Solutions/view-part/?ref=snap
19_PINOUT = PPTC191LFBN-RC: MFR_NAME: Sullins; GateName_1: A; SymbolName_1: CONN19_PPTC191LFBN-RC; LibraryName: PPTC191LFBN-RC; DeviceSetName: PPTC191LFBN-RC; COPYRIGHT: Copyright (C) 2023 Ultra Librarian. All rights reserved.; MANUFACTURER_PART_NUMBER: PPTC191LFBN-RC; TYPE: Headers, Receptacles, Female Sockets
BAT_JP = 282837-2: TERM BLOCK 5.08MM 2POS SIDE ENTY Check availability; GateName_1: G$1; MF: TE Connectivity; SymbolName_1: 282837-2; LibraryName: Terminal_Block2P; DeviceSetName: 282837-2; AVAILABILITY: In Stock; CHECK_PRICES: https://www.snapeda.com/parts/282837-2/TE+Connectivity+AMP+Connectors/view-part/?ref=eda; MP: 282837-2; PACKAGE: None; PRICE: None; PURCHASE-URL: https://pricing.snapeda.com/search?q=282837-2&ref=eda; SNAPEDA_LINK: https://www.snapeda.com/parts/282837-2/TE+Connectivity+AMP+Connectors/view-part/?ref=snap
C3.3MCU C3.3MCU1 C3.3OUT1-C3.3OUT12 CBOOT CBOOT1 CBUS CENMCU CENS CENS1 CIN CIN1-CIN5 CINX CINX1-CINX5 COUT COUT1-COUT5 CSS CSS1 CUSB CUSB1-CUSB3 CUSB5 CVCC CVCC1 SDVC = C-EUC0805: CAPACITOR, European symbol; GateName_1: G$1; SymbolName_1: C-EU; POPULARITY: 88; DeviceName: C0805; LibraryName: rcl; DeviceSetName: C-EU; SPICEPREFIX: C
CTS_NC DCD_NC U$2 U$10 U$11 = NC_MARKER: GateName_1: G$1; SymbolName_1: NO_CONNECT_MARKER; LibraryName: NC_MARKER; DeviceSetName: NC_MARKER; _EXTERNAL_: _EXTERNAL_
D1 D5 D13 = 1N5819HW-7-F: 1N5819HW Series 40 V 1 A Surface Mount Schottky Barrier Rectifier - SOD-123 Check availability; GateName_1: G$1; MF: Diodes Inc.; SymbolName_1: 1N5819HW-7-F; LibraryName: 1N5819HW-7-F; DeviceSetName: 1N5819HW-7-F; AVAILABILITY: In Stock; CHECK_PRICES: https://www.snapeda.com/parts/1N5819HW-7-F/Diodes+Inc./view-part/?ref=eda; MP: 1N5819HW-7-F; PACKAGE: SOD-123 Fairchild Semiconductor; PRICE: None; PURCHASE-URL: https://www.snapeda.com/api/url_track_click_mouser/?unipart_id=42272&manufacturer=Diodes Inc.&part_name=1N5819HW-7-F&search_term=1n5819hw-7-f; SNAPEDA_LINK: https://www.snapeda.com/parts/1N5819HW-7-F/Diodes+Inc./view-part/?ref=snap
D2-D4 D6-D8 D14-D16 = CPDQ5V0-HF: ESD Suppressors / TVS Diodes SMD ESD Diode 5V Bi-Direction   Source:  Datasheet   Check availability; GateName_1: G$1; MF: Comchip Technology; SymbolName_1: CPDQ5V0-HF; LibraryName: CPDQ5V0-HF; DeviceSetName: CPDQ5V0-HF; AVAILABILITY: In Stock; CHECK_PRICES: https://www.snapeda.com/parts/CPDQ5V0-HF/Comchip+Technology/view-part/?ref=eda; MP: CPDQ5V0-HF; PACKAGE: 0402 Comchip; PRICE: None; PURCHASE-URL: https://www.snapeda.com/api/url_track_click_mouser/?unipart_id=809934&manufacturer=Comchip Technology&part_name=CPDQ5V0-HF&search_term=cpdq5v0-hf; SNAPEDA_LINK: https://www.snapeda.com/parts/CPDQ5V0-HF/Comchip+Technology/view-part/?ref=snap
DA_CONVERTER_SD = CD74HC4050MT: Check availability; GateName_1: A; MF: Texas Instruments; SymbolName_1: CD74HC4050MT; LibraryName: CD74HC4050MT; DeviceSetName: CD74HC4050MT; AVAILABILITY: In Stock; CHECK_PRICES: https://www.snapeda.com/parts/CD74HC4050MT/Texas+Instruments/view-part/?ref=eda; MP: CD74HC4050MT; PACKAGE: SOIC-16 Texas Instruments; PRICE: None; PURCHASE-URL: https://www.snapeda.com/api/url_track_click_mouser/?unipart_id=1170164&manufacturer=Texas Instruments&part_name=CD74HC4050MT&search_term=cd74hc4050; SNAPEDA_LINK: https://www.snapeda.com/parts/CD74HC4050MT/Texas+Instruments/view-part/?ref=snap
I2C_USBC_IN STEPPER_USBC_IN UART_USBC_IN = USB4110-GF-A: MFR_NAME: Global Connector Technology; GateName_1: A; SymbolName_1: USB4110-GF-A; LibraryName: USB4110-GF-A; DeviceSetName: USB4110-GF-A; COPYRIGHT: Copyright (C) 2023 Ultra Librarian. All rights reserved.; MANUFACTURER_PART_NUMBER: USB4110-GF-A
L1 L2 = L-US6000-XXX-RC: INDUCTOR, American symbol; GateName_1: G$1; SymbolName_1: L-US; POPULARITY: 5; DeviceName: 6000-XXX-RC; LibraryName: rcl; DeviceSetName: L-US; SPICEPREFIX: L
LED1-LED3 = LED: LED   OSRAM: - CHIPLED LG R971, LG N971, LY N971, LG Q971, LY Q971, LO R971, LY R971 LH N974, LH R974 LS Q976, LO Q976, LY Q976 LO Q996 - Hyper CHIPLED LW Q18S LB Q993, LB Q99A, LB R99A - SideLED LS A670, LO A670, LY A670, LG A670, LP A670 LB A673, LV A673, LT A673, LW A673 LH A674 LY A675 LS A676, LA A676, LO A676, LY A676, LW A676 LS A679, LY A679, LG A679 -  Hyper Micro SIDELEDÂ® LS Y876, LA Y876, LO Y876, LY Y876 LT Y87S - SmartLED LW L88C, LW L88S LB L89C, LB L89S, LG L890 LS L89K, LO L89K, LY L89K LS L896, LA L896, LO L896, LY L896 - TOPLED LS T670, LO T670, LY T670, LG T670, LP T670 LSG T670, LSP T670, LSY T670, LOP T670, LYG T670 LG T671, LOG T671, LSG T671 LB T673, LV T673, LT T673, LW T673 LH T674 LS T676, LA T676, LO T676, LY T676, LB T676, LH T676, LSB T676, LW T676 LB T67C, LV T67C, LT T67C, LS T67K, LO T67K, LY T67K, LW E67C LS E67B, LA E67B, LO E67B, LY E67B, LB E67C, LV E67C, LT E67C LW T67C LS T679, LY T679, LG T679 LS T770, LO T770, LY T770, LG T770, LP T770 LB T773, LV T773, LT T773, LW T773 LH T774 LS E675, LA E675, LY E675, LS T675 LS T776, LA T776, LO T776, LY T776, LB T776 LHGB T686 LT T68C, LB T68C - Hyper Mini TOPLEDÂ® LB M676 - Mini TOPLED SantanaÂ® LG M470 LS M47K, LO M47K, LY M47K    Source: http://www.osram.convergy.de/; GateName_1: G$1; SymbolName_1: LED; LibraryName: adafruit; DeviceSetName: LED
MCU = ESP32-C6-WROOM-1-N8: MFR_NAME: Espressif Systems; GateName_1: A; SymbolName_1: ESP32-C6-WROOM-1(U); LibraryName: ESP32-C6-WROOM-1U; DeviceSetName: ESP32-C6-WROOM-1-N8; COPYRIGHT: Copyright (C) 2023 Ultra Librarian. All rights reserved.; MANUFACTURER_PART_NUMBER: ESP32-C6-WROOM-1-N8; TYPE: RF
MCU_P_JP = JP1Q: JUMPER; GateName_1: A; SymbolName_1: J1; POPULARITY: 15; LibraryName: jumper; DeviceSetName: JP1Q
OP_AMP_LEDS = LM358DR: Check availability; GateName_1: A; MF: Texas Instruments; SymbolName_1: LM358DR; LibraryName: LM358DR; DeviceSetName: LM358DR; AVAILABILITY: In Stock; CHECK_PRICES: https://www.snapeda.com/parts/LM358DR/Texas+Instruments/view-part/?ref=eda; MP: LM358DR; PACKAGE: SOIC-8 Texas Instruments; PRICE: None; PURCHASE-URL: https://www.snapeda.com/api/url_track_click_mouser/?unipart_id=6639&manufacturer=Texas Instruments&part_name=LM358DR&search_term=lm358dr; SNAPEDA_LINK: https://www.snapeda.com/parts/LM358DR/Texas+Instruments/view-part/?ref=snap
Q1 Q2 = SS8050-G: Bipolar (BJT) Transistor NPN 25 V 1.5 A 100MHz 300 mW Surface Mount SOT-23-3   Check availability; GateName_1: G$1; MF: Comchip Technology; SymbolName_1: SS8050-G; LibraryName: SS8050-G; DeviceSetName: SS8050-G; AVAILABILITY: In Stock; CHECK_PRICES: https://www.snapeda.com/parts/SS8050-G/Comchip+Technology/view-part/?ref=eda; MP: SS8050-G; PACKAGE: TO-236 Comchip; PRICE: None; PURCHASE-URL: https://www.snapeda.com/api/url_track_click_mouser/?unipart_id=809142&manufacturer=Comchip Technology&part_name=SS8050-G&search_term=ss8050-g; SNAPEDA_LINK: https://www.snapeda.com/parts/SS8050-G/Comchip+Technology/view-part/?ref=snap
RENB RENB1 RENMCU RENMCU1 RENMCU2 RENT RENT1 RFAULT2-RFAULT4 RFBB RFBB1 RFBT RFBT1 RILIM RILIM1 RILIM2 RLEDOUT RLEDOUT1-RLEDOUT3 RLEDOUT8 RLEDOUT9 RMODE RMODE1 RPG RPG1 RSDCS RTRIP RTRIP1 RU1-RU6 RUSB RUSB1-RUSB3 RUSB6 RUSB7 = R-US_M0805: RESISTOR, American symbol; GateName_1: G$1; SymbolName_1: R-US; DeviceSetName: R-US_; POPULARITY: 45; DeviceName: M0805; LibraryName: rcl; SPICEPREFIX: R
SD_CONNECTOR = MICROSD: Micro-SD / Transflash card holder with SPI pinout   For the 3M # 2908-05WB-MG and/or 4UCON #19656 push-push type; GateName_1: G$1; SymbolName_1: TRANSFLASH; LibraryName: adafruit; DeviceSetName: MICROSD
SENSOR_PSWITCH SERVO_PSWITCH STEPPER_P_SWITCH = AP22653W6-7: Power Switch/Driver 1:1 P-Channel 2.1A SOT-23-6  Check availability; GateName_1: G$1; MF: Diodes Incorporated; SymbolName_1: AP22653W6-7; LibraryName: AP22653W6-7; DeviceSetName: AP22653W6-7; AVAILABILITY: In Stock; CHECK_PRICES: https://www.snapeda.com/parts/AP22653W6-7/Diodes+Inc./view-part/?ref=eda; MP: AP22653W6-7; PACKAGE: SOT-23-6 Diodes Incorporated; PRICE: None; PURCHASE-URL: https://www.snapeda.com/api/url_track_click_mouser/?unipart_id=4792807&manufacturer=Diodes Incorporated&part_name=AP22653W6-7&search_term=ap22653w6-7; SNAPEDA_LINK: https://www.snapeda.com/parts/AP22653W6-7/Diodes+Inc./view-part/?ref=snap
SENSOR_USBA_IN = USB-AP-S-RA-SMT: MFR_NAME: ADAM TECHNOLOGIES INC; GateName_1: A; SymbolName_1: CONN_004P_000C_1; LibraryName: USB-AP-S-RA-SMT; DeviceSetName: USB-AP-S-RA-SMT; COPYRIGHT: Copyright (C) 2023 Ultra Librarian. All rights reserved.; MANUFACTURER_PART_NUMBER: USB-AP-S-RA-SMT
SW4 SW5 = 1825910-6: Switch Tactile OFF (ON) SPST Round Button PC Pins 0.05A 24VDC 100000Cycles 1.57N Thru-Hole Loose Check availability; GateName_1: G$1; MF: TE Connectivity; SymbolName_1: 1825910-6; LibraryName: 1825910-6; DeviceSetName: 1825910-6; AVAILABILITY: In Stock; CHECK_PRICES: https://www.snapeda.com/parts/1825910-6/TE+Connectivity+ALCOSWITCH+Switches/view-part/?ref=eda; MP: 1825910-6; PACKAGE: None; PRICE: None; PURCHASE-URL: https://www.snapeda.com/api/url_track_click_mouser/?unipart_id=226996&manufacturer=TE Connectivity&part_name=1825910-6&search_term=1825910-6; SNAPEDA_LINK: https://www.snapeda.com/parts/1825910-6/TE+Connectivity+ALCOSWITCH+Switches/view-part/?ref=snap
U14 = MMSZ5225BT1G: MFR_NAME: onsemi; GateName_1: A; SymbolName_1: MMSZ5225BT1G; LibraryName: MMSZ5225BT1G; DeviceSetName: MMSZ5225BT1G; COPYRIGHT: Copyright (C) 2023 Ultra Librarian. All rights reserved.; MANUFACTURER_PART_NUMBER: MMSZ5225BT1G
U15 = MMSZ5230BT1G: MFR_NAME: onsemi; GateName_1: A; SymbolName_1: MMSZ5230BT1G; LibraryName: MMSZ5230BT1G; DeviceSetName: MMSZ5230BT1G; COPYRIGHT: Copyright (C) 2023 Ultra Librarian. All rights reserved.; MANUFACTURER_PART_NUMBER: MMSZ5230BT1G
UART_USB_CONVERTER = CP2102N-A02-GQFN28: Check availability; GateName_1: G$1; MF: Silicon Labs; SymbolName_1: CP2102N-A02-GQFN28; LibraryName: CP2102N-A02-GQFN28; DeviceSetName: CP2102N-A02-GQFN28; AVAILABILITY: In Stock; CHECK_PRICES: https://www.snapeda.com/parts/CP2102N-A02-GQFN28/Silicon+Labs/view-part/?ref=eda; MP: CP2102N-A02-GQFN28; PACKAGE: WFQFN-28 Silicon Labs; PRICE: None; PURCHASE-URL: https://www.snapeda.com/api/url_track_click_mouser/?unipart_id=4872321&manufacturer=Silicon Labs&part_name=CP2102N-A02-GQFN28&search_term=cp2102n-a02-gqfn28; SNAPEDA_LINK: https://www.snapeda.com/parts/CP2102N-A02-GQFN28/Silicon+Labs/view-part/?ref=snap